# EAGLE design power-board-sss (EAGLE 9.6.2)
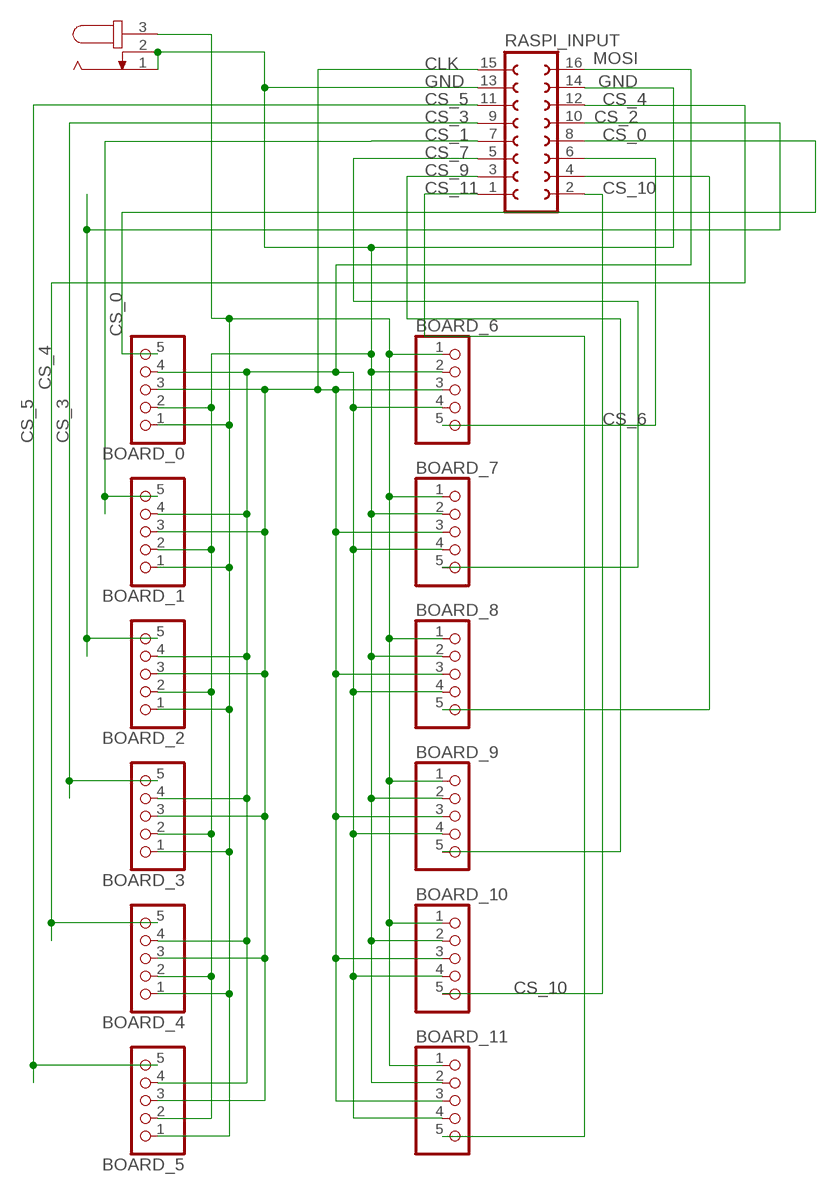
[diagram p0: schematic, sheet 1]

## Parts
BOARD_0  PINHD-1X5  [1X05]
BOARD_1  PINHD-1X5  [1X05]
BOARD_2  PINHD-1X5  [1X05]
BOARD_3  PINHD-1X5  [1X05]
BOARD_4  PINHD-1X5  [1X05]
BOARD_5  PINHD-1X5  [1X05]
BOARD_6  PINHD-1X5  [1X05]
BOARD_7  PINHD-1X5  [1X05]
BOARD_8  PINHD-1X5  [1X05]
BOARD_9  PINHD-1X5  [1X05]
BOARD_10  PINHD-1X5  [1X05]
BOARD_11  PINHD-1X5  [1X05]
J1  JACK-PLUG1  [SPC4078]
RASPI_INPUT  FE08-2  [FE08-2]

## Nets
CLK [signals]: BOARD_0.3 BOARD_1.3 BOARD_2.3 BOARD_3.3 BOARD_4.3 BOARD_5.3 BOARD_6.3 BOARD_7.3 BOARD_8.3 BOARD_9.3 BOARD_10.3 BOARD_11.3 RASPI_INPUT.15
CS_0 [signals]: BOARD_0.5 RASPI_INPUT.8
CS_1 [signals]: BOARD_1.5 RASPI_INPUT.7
CS_2 [signals]: BOARD_2.5 RASPI_INPUT.10
CS_3 [signals]: BOARD_3.5 RASPI_INPUT.9
CS_4 [signals]: BOARD_4.5 RASPI_INPUT.12
CS_5 [signals]: BOARD_5.5 RASPI_INPUT.11
CS_6 [signals]: BOARD_6.5 RASPI_INPUT.6
CS_7 [signals]: BOARD_7.5 RASPI_INPUT.5
CS_8 [signals]: BOARD_8.5 RASPI_INPUT.4
CS_9 [signals]: BOARD_9.5 RASPI_INPUT.3
CS_10 [signals]: BOARD_10.5 RASPI_INPUT.2
CS_11 [signals]: BOARD_11.5 RASPI_INPUT.1
GND [signals]: BOARD_0.2 BOARD_1.2 BOARD_2.2 BOARD_3.2 BOARD_4.2 BOARD_5.2 BOARD_6.2 BOARD_7.2 BOARD_8.2 BOARD_9.2 BOARD_10.2 BOARD_11.2 J1.1 J1.2 RASPI_INPUT.13 RASPI_INPUT.14
MOSI [signals]: BOARD_0.4 BOARD_1.4 BOARD_2.4 BOARD_3.4 BOARD_4.4 BOARD_5.4 BOARD_6.4 BOARD_7.4 BOARD_8.4 BOARD_9.4 BOARD_10.4 BOARD_11.4 RASPI_INPUT.16
VCC [VCC]: BOARD_0.1 BOARD_1.1 BOARD_2.1 BOARD_3.1 BOARD_4.1 BOARD_5.1 BOARD_6.1 BOARD_7.1 BOARD_8.1 BOARD_9.1 BOARD_10.1 BOARD_11.1 J1.3

## Library data of the parts
BOARD_0 BOARD_1-BOARD_11 = pinhead:PINHD-1X5: PIN HEADER
J1 = con-jack:JACK-PLUG: DC POWER JACK Power Jack, DC, Right Angle, Through Hole, Rated 5A at 16VDC, PC Terminals Distributor: Farnell (www.Farnell.de) Drawing: 84N1161.pdf / 84N1162.pdf Manufacturer: SPC Technology (www.spctechnology.com) Type: SPC4077 / SPC 4078; OC_FARNELL: unknown; OC_NEWARK: unknown
RASPI_INPUT = con-lsta:FE08-2: FEMALE HEADER; OC_FARNELL: unknown; OC_NEWARK: unknown

## Net classes
0 default: width 0.406 mm, clearance 0.254 mm
1 signals: width 0.406 mm, clearance 0.254 mm
2 VCC: width 2.54 mm, clearance 0.254 mm

## Board
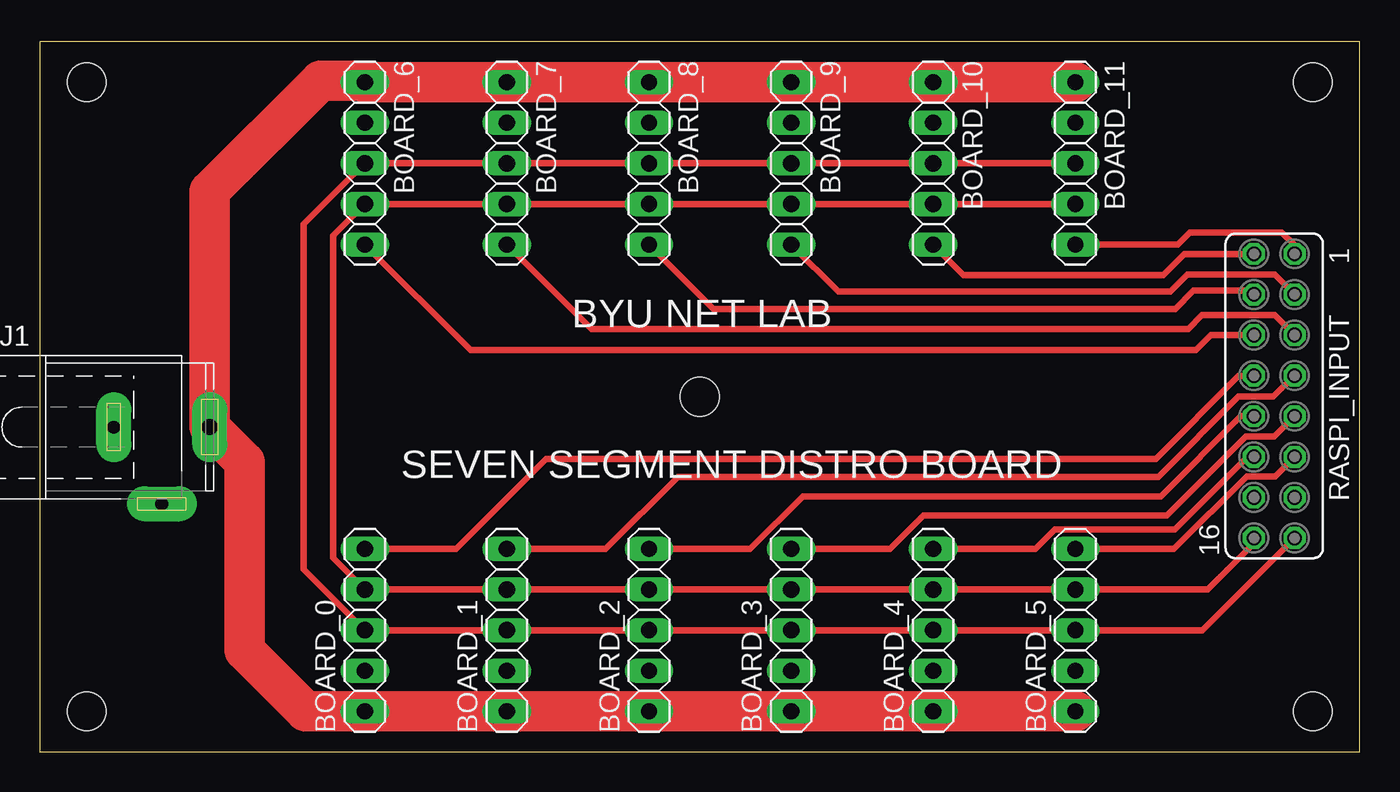
[diagram p1: board, top side]
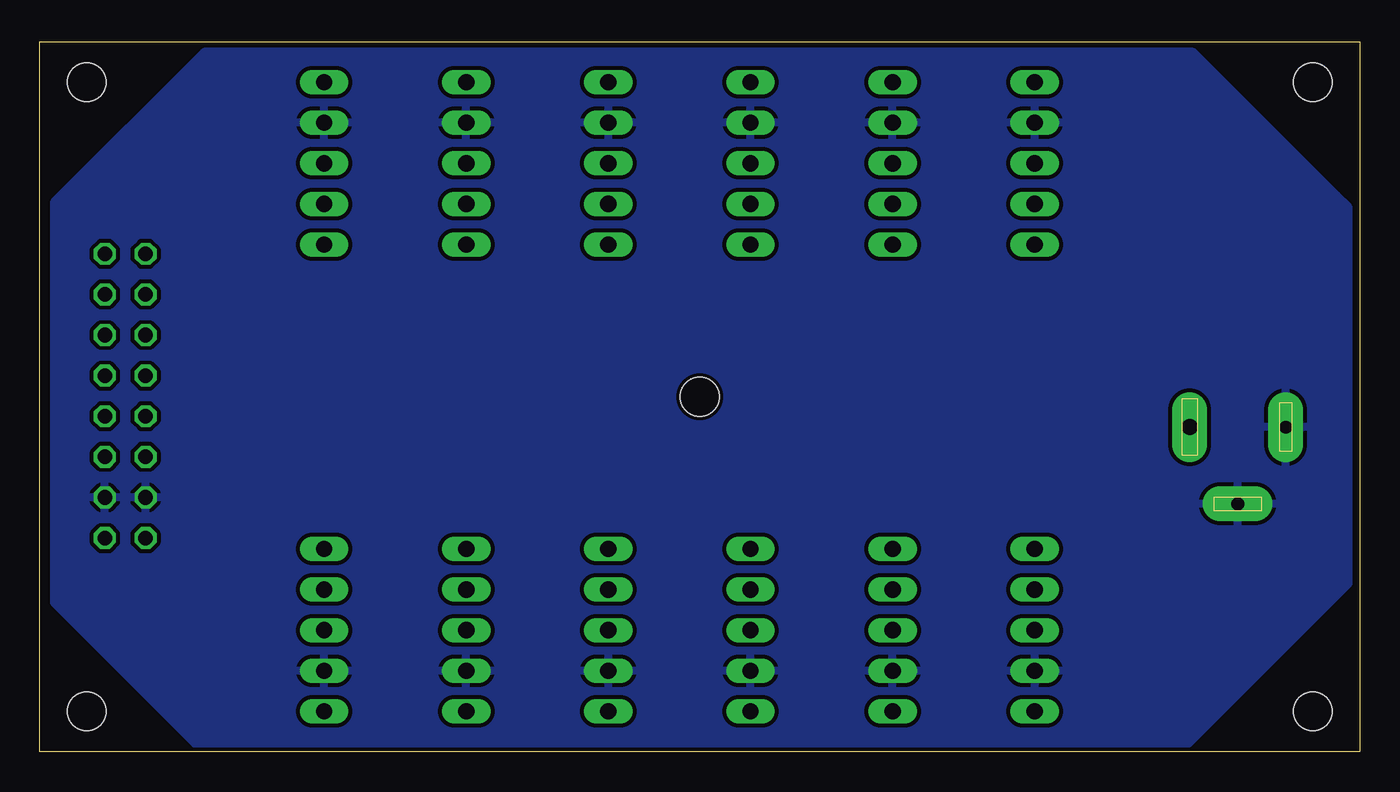
[diagram p2: board, bottom side, seen from below]

Size 82.55 x 44.45 mm. Coordinates in mm from the lower left corner, seen from the top.
Outline: 0,0 82.55,0 82.55,44.45 0,44.45 0,0
Copper layers (1*16): Top 0.035559375mm / dielectric 1.6mm / Bottom 0.035559375mm
Design rules "jlcpcb2layer": minimum track width 5mil, minimum drill 12mil, track to track 5mil, track to pad 5mil, pad to pad 5mil, via to via 5mil, smd to smd 5mil, copper to edge 8mil, drill to drill 6mil, minimum pad ring 5mil, minimum via ring 3mil, stop-mask expansion 2.5mil, vias tented up to drill 0mil, thermal gap 10mil
Holes 2.41 mm at 2.92,41.91 79.63,41.91 79.63,2.54 41.27,22.23 2.92,2.54

### Footprints (pad centres in the part's own frame; a part is rotated, then mirrored left to right if it is on the bottom)
1X05 = drill 1.016 long: 1 -5.08,0; 2 -2.54,0; 3 0,0; 4 2.54,0; 5 5.08,0
SPC4078 = drill 0.8 pad 2.184 long: 1 -3,0; 2 0,-4.8 | drill 1 pad 2.184 long: 3 3,0
FE08-2 = drill 0.914 octagon: 1 -8.89,1.27; 2 -8.89,-1.27; 3 -6.35,1.27; 4 -6.35,-1.27; 5 -3.81,1.27; 6 -3.81,-1.27; 7 -1.27,1.27; 8 -1.27,-1.27; 9 1.27,1.27; 10 1.27,-1.27; 11 3.81,1.27; 12 3.81,-1.27; 13 6.35,1.27; 14 6.35,-1.27; 15 8.89,1.27; 16 8.89,-1.27

### Placement (x,y rotation side)
BOARD_0  20.32,7.62 90 top
BOARD_1  29.21,7.62 90 top
BOARD_2  38.1,7.62 90 top
BOARD_3  46.99,7.62 90 top
BOARD_4  55.88,7.62 90 top
BOARD_5  64.77,7.62 90 top
BOARD_6  20.32,36.83 270 top
BOARD_7  29.21,36.83 270 top
BOARD_8  38.1,36.83 270 top
BOARD_9  46.99,36.83 270 top
BOARD_10  55.88,36.83 270 top
BOARD_11  64.77,36.83 270 top
J1  7.62,20.32 0 top
RASPI_INPUT  77.22,22.28 270 top

### Tracks (layer width: path | path; a pad name or v marks a point on that pad's centre or on a via)
CLK
  Top 0.406: RASPI_INPUT.15 72.72,7.62 BOARD_5.3 BOARD_4.3 BOARD_3.3 BOARD_2.3 BOARD_1.3 BOARD_0.3 16.51,11.43 16.51,33.02 BOARD_6.3 BOARD_7.3 BOARD_8.3 BOARD_9.3 BOARD_10.3 BOARD_11.3
CS_0
  Top 0.406: BOARD_0.5 26.04,12.7 31.67,18.34 69.8,18.34 74.98,23.52 75.92,23.52 RASPI_INPUT.8
CS_1
  Top 0.406: RASPI_INPUT.7 77.17,22.23 74.95,22.23 69.95,17.22 39.9,17.22 35.38,12.7 BOARD_1.5
CS_2
  Top 0.406: BOARD_2.5 44.42,12.7 47.73,16 70.1,16 75.11,21.01 RASPI_INPUT.10
CS_3
  Top 0.406: BOARD_3.5 53.16,12.7 55.27,14.81 70.51,14.81 75.44,19.74 77.22,19.74 RASPI_INPUT.9
CS_4
  Top 0.406: BOARD_4.5 62.28,12.7 63.5,13.92 70.99,13.92 75.54,18.47 RASPI_INPUT.12
CS_5
  Top 0.406: RASPI_INPUT.11 77.27,17.25 75.49,17.25 70.94,12.7 BOARD_5.5
CS_6
  Top 0.406: RASPI_INPUT.6 73.25,26.09 72.31,25.15 26.92,25.15 BOARD_6.5
CS_7
  Top 0.406: RASPI_INPUT.5 77.24,27.33 72.69,27.33 71.83,26.47 34.49,26.47 BOARD_7.5
CS_8
  Top 0.406: RASPI_INPUT.4 75.72,28.85 72.16,28.85 71.02,27.71 42.14,27.71 BOARD_8.5
CS_9
  Top 0.406: RASPI_INPUT.3 77.24,29.87 71.78,29.87 70.71,28.8 49.94,28.8 BOARD_9.5
CS_10
  Top 0.406: BOARD_10.5 55.88,31.73 57.76,29.84 70.28,29.84 71.6,31.17 RASPI_INPUT.2
CS_11
  Top 0.406: BOARD_11.5 71.17,31.75 71.93,32.51 77.67,32.51 78.49,31.7 RASPI_INPUT.1
GND
  pour Bottom (isolate 0.254): 1.42,34.82 10.41,43.81 70.36,43.81 71.86,43.81 72.26,43.81 72.31,43.76 81.69,34.39 81.69,33.99 81.69,9.35 72.85,0.51 10.72,0.51 0.69,10.54 0.69,34.09
MOSI
  Top 0.406: RASPI_INPUT.16 75.95,13.06 73.05,10.16 BOARD_5.4 BOARD_4.4 BOARD_3.4 BOARD_2.4 BOARD_1.4 BOARD_0.4 18.34,12.14 18.34,32.31 BOARD_6.4 BOARD_7.4 BOARD_8.4 BOARD_9.4 BOARD_10.4 BOARD_11.4
VCC
  Top 2.54: BOARD_5.1 BOARD_4.1 BOARD_3.1 BOARD_2.1 BOARD_1.1 BOARD_0.1 16.61,2.54 12.8,6.35 12.8,18.14 J1.3 10.62,35.08 17.55,42.01 20.22,42.01 BOARD_6.1 BOARD_7.1 BOARD_8.1 BOARD_9.1 BOARD_10.1 BOARD_11.1

### Text on the board
tNames: BYU NET LAB | SEVEN SEGMENT DISTRO BOARD